# EAGLE design GraphicDisplay (EAGLE 6.5.0)
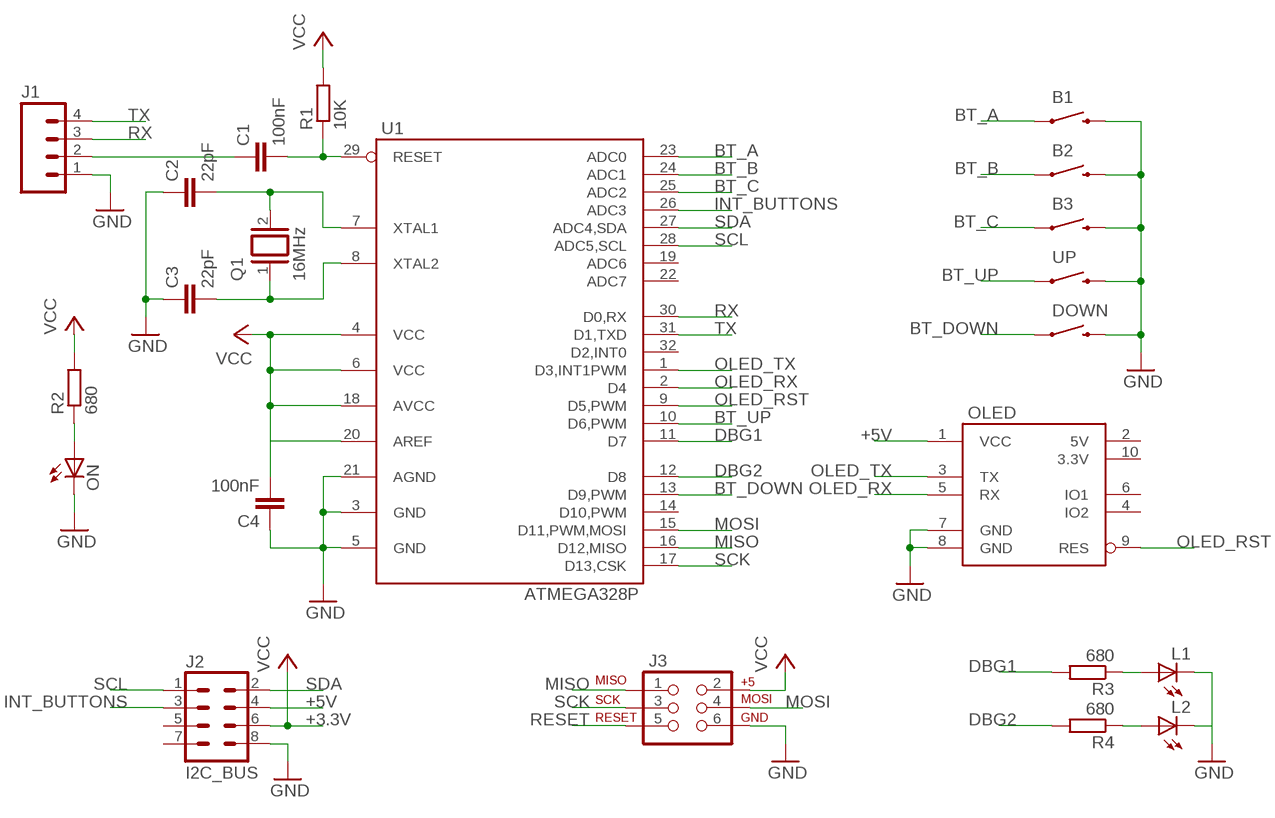
[diagram p0: schematic, sheet 1]

## Parts
B1  SWITCH-MOMENTARY-212MM  [TACTILE-PTH-12MM]
B2  SWITCH-MOMENTARY-212MM  [TACTILE-PTH-12MM]
B3  SWITCH-MOMENTARY-212MM  [TACTILE-PTH-12MM]
C1  100nF  C-EUC0805  [C0805]
C2  22pF  C-EUC0805  [C0805]
C3  22pF  C-EUC0805  [C0805]
C4  100nF  C-EUC0805  [C0805]
DOWN  SWITCH-MOMENTARY-212MM  [TACTILE-PTH-12MM]
J1  M04PTH  [1X04]
J2  I2C_BUS  IDC-SOCKET04X2IDC_SOCKECT04X2_ANGLE  [SOCKET04X2_ANGLE]
J3  AVR_SPI_PRG_6NS  [2X3-NS]
L1  LEDCHIP-LED0805  [CHIP-LED0805]
L2  LEDCHIP-LED0805  [CHIP-LED0805]
OLED  UOLED-160-G2  [UOLED-160-G2]
ON  LEDCHIP-LED0805  [CHIP-LED0805]
Q1  16MHz  XTAL/S  [QS]
R1  10K  R-EU_R0805  [R0805]
R2  680  R-EU_R0805  [R0805]
R3  680  R-EU_R0805  [R0805]
R4  680  R-EU_R0805  [R0805]
U1  ATMEGA328P  ATMEGA328-SMT  [TQFP32-08]
UP  SWITCH-MOMENTARY-212MM  [TACTILE-PTH-12MM]

## Nets
+5V: J2.4 OLED.1(VCC)
BT_A: B1.1 U1.23(ADC0)
BT_B: B2.1 U1.24(ADC1)
BT_C: B3.1 U1.25(ADC2)
BT_DOWN: DOWN.1 U1.13(D9,PWM)
BT_UP: U1.10(D6,PWM) UP.1
DBG1: R3.2 U1.11(D7)
DBG2: R4.2 U1.12(D8)
GND: B1.3 B2.3 B3.3 C2.1 C3.1 C4.1 DOWN.3 J1.1 J2.8 J3.6 L1.C L2.C OLED.7(GND) OLED.8(GND) ON.C U1.3(GND) U1.5(GND) U1.21(AGND) UP.3
INT_BUTTONS: J2.3 U1.26(ADC3)
MISO: J3.1 U1.16(D12,MISO)
MOSI: J3.4 U1.15(D11,PWM,MOSI)
N$1: C1.1 J1.2
N$3: C2.2 Q1.2 U1.7(XTAL1)
N$4: C3.2 Q1.1 U1.8(XTAL2)
N$5: ON.A R2.1
N$6: L1.A R3.1
N$7: L2.A R4.1
OLED_RST: OLED.9(RES) U1.9(D5,PWM)
OLED_RX: OLED.5(RX) U1.2(D4)
OLED_TX: OLED.3(TX) U1.1(D3,INT1PWM)
RESET: C1.2 J3.5 R1.1 U1.29(RESET)
RX: J1.3 U1.30(D0,RX)
SCK: J3.3 U1.17(D13,CSK)
SCL: J2.1 U1.28(ADC5,SCL)
SDA: J2.2 U1.27(ADC4,SDA)
TX: J1.4 U1.31(D1,TXD)
VCC: C4.2 J2.6 J3.2 R1.2 R2.2 U1.4(VCC) U1.6(VCC) U1.18(AVCC) U1.20(AREF)
Unconnected: J2.5 J2.7 OLED.4(IO2) OLED.6(IO1) U1.14(D10,PWM) U1.19(ADC6) U1.22(ADC7) U1.32(D2,INT0)

## Notes on the sheet
- +3.3V

## Power pins joined to a net without a drawn wire
3.3V: OLED.10(3.3V)
5V: OLED.2(5V)

## Library data of the parts
B1-B3 DOWN UP = SparkFun-Electromechanical:SWITCH-MOMENTARY-2: Various NO switches- pushbuttons, reed, etc
C1-C4 = resistor:C-EU: CAPACITOR, European symbol
J1 = SparkFun-Connectors:M04: Header 4 Standard 4-pin 0.1" header. Use with straight break away headers (SKU : PRT-00116), right angle break away headers (PRT-00553), swiss pins (PRT-00743), machine pins (PRT-00117), and female headers (PRT-00115). Molex polarized connector foot print use with SKU : PRT-08231 with associated crimp pins and housings. 1MM SMD Version SKU: PRT-10208
J2 = Connectors:IDC-SOCKET04X2
J3 = SparkFun-Connectors:AVR_SPI_PRG_6: AVR ISP 6 Pin This is the reduced ISP connector for AVR programming. Common on Arduino. This footprint will take up less PCB space and can be used with a 10-pin to 6-pin adapter such as SKU: BOB-08508
L1 L2 ON = led:LED: LED OSRAM: - CHIPLED LG R971, LG N971, LY N971, LG Q971, LY Q971, LO R971, LY R971 LH N974, LH R974 LS Q976, LO Q976, LY Q976 LO Q996 - Hyper CHIPLED LW Q18S LB Q993, LB Q99A, LB R99A - SideLED LS A670, LO A670, LY A670, LG A670, LP A670 LB A673, LV A673, LT A673, LW A673 LH A674 LY A675 LS A676, LA A676, LO A676, LY A676, LW A676 LS A679, LY A679, LG A679 - Hyper Micro SIDELED® LS Y876, LA Y876, LO Y876, LY Y876 LT Y87S - SmartLED LW L88C, LW L88S LB L89C, LB L89S, LG L890 LS L89K, LO L89K, LY L89K LS L896, LA L896, LO L896, LY L896 - TOPLED LS T670, LO T670, LY T670, LG T670, LP T670 LSG T670, LSP T670, LSY T670, LOP T670, LYG T670 LG T671, LOG T671, LSG T671 LB T673, LV T673, LT T673, LW T673 LH T674 LS T676, LA T676, LO T676, LY T676, LB T676, LH T676, LSB T676, LW T676 LB T67C, LV T67C, LT T67C, LS T67K, LO T67K, LY T67K, LW E67C LS E67B, LA E67B, LO E67B, LY E67B, LB E67C, LV E67C, LT E67C LW T67C LS T679, LY T679, LG T679 LS T770, LO T770, LY T770, LG T770, LP T770 LB T773, LV T773, LT T773, LW T773 LH T774 LS E675, LA E675, LY E675, LS T675 LS T776, LA T776, LO T776, LY T776, LB T776 LHGB T686 LT T68C, LB T68C - Hyper Mini TOPLED® LB M676 - Mini TOPLED Santana® LG M470 LS M47K, LO M47K, LY M47K Source: http://www.osram.convergy.de LUXEON: - LUMILED® LXK2-PW12-R00, LXK2-PW12-S00, LXK2-PW14-U00, LXK2-PW14-V00 LXK2-PM12-R00, LXK2-PM12-S00, LXK2-PM14-U00 LXK2-PE12-Q00, LXK2-PE12-R00, LXK2-PE12-S00, LXK2-PE14-T00, LXK2-PE14-U00 LXK2-PB12-K00, LXK2-PB12-L00, LXK2-PB12-M00, LXK2-PB14-N00, LXK2-PB14-P00, LXK2-PB14-Q00 LXK2-PR12-L00, LXK2-PR12-M00, LXK2-PR14-Q00, LXK2-PR14-R00 LXK2-PD12-Q00, LXK2-PD12-R00, LXK2-PD12-S00 LXK2-PH12-R00, LXK2-PH12-S00 LXK2-PL12-P00, LXK2-PL12-Q00, LXK2-PL12-R00 Source: www.luxeon.com KINGBRIGHT: KA-3528ASYC Source: www.kingbright.com
OLED = 4D-Systems:UOLED-160-G2
Q1 = special:XTAL/S: CRYSTAL
R1-R4 = resistor:R-EU_: RESISTOR, European symbol
U1 = Arduino:ATMEGA328-SMT: 32-Pin Atmega328 part Commonly used on Arduino compatible boards Available in QFP and QFN packages TQFP is IC-09069 QFN is non-stock; PROD_ID: IC-09069

## Board
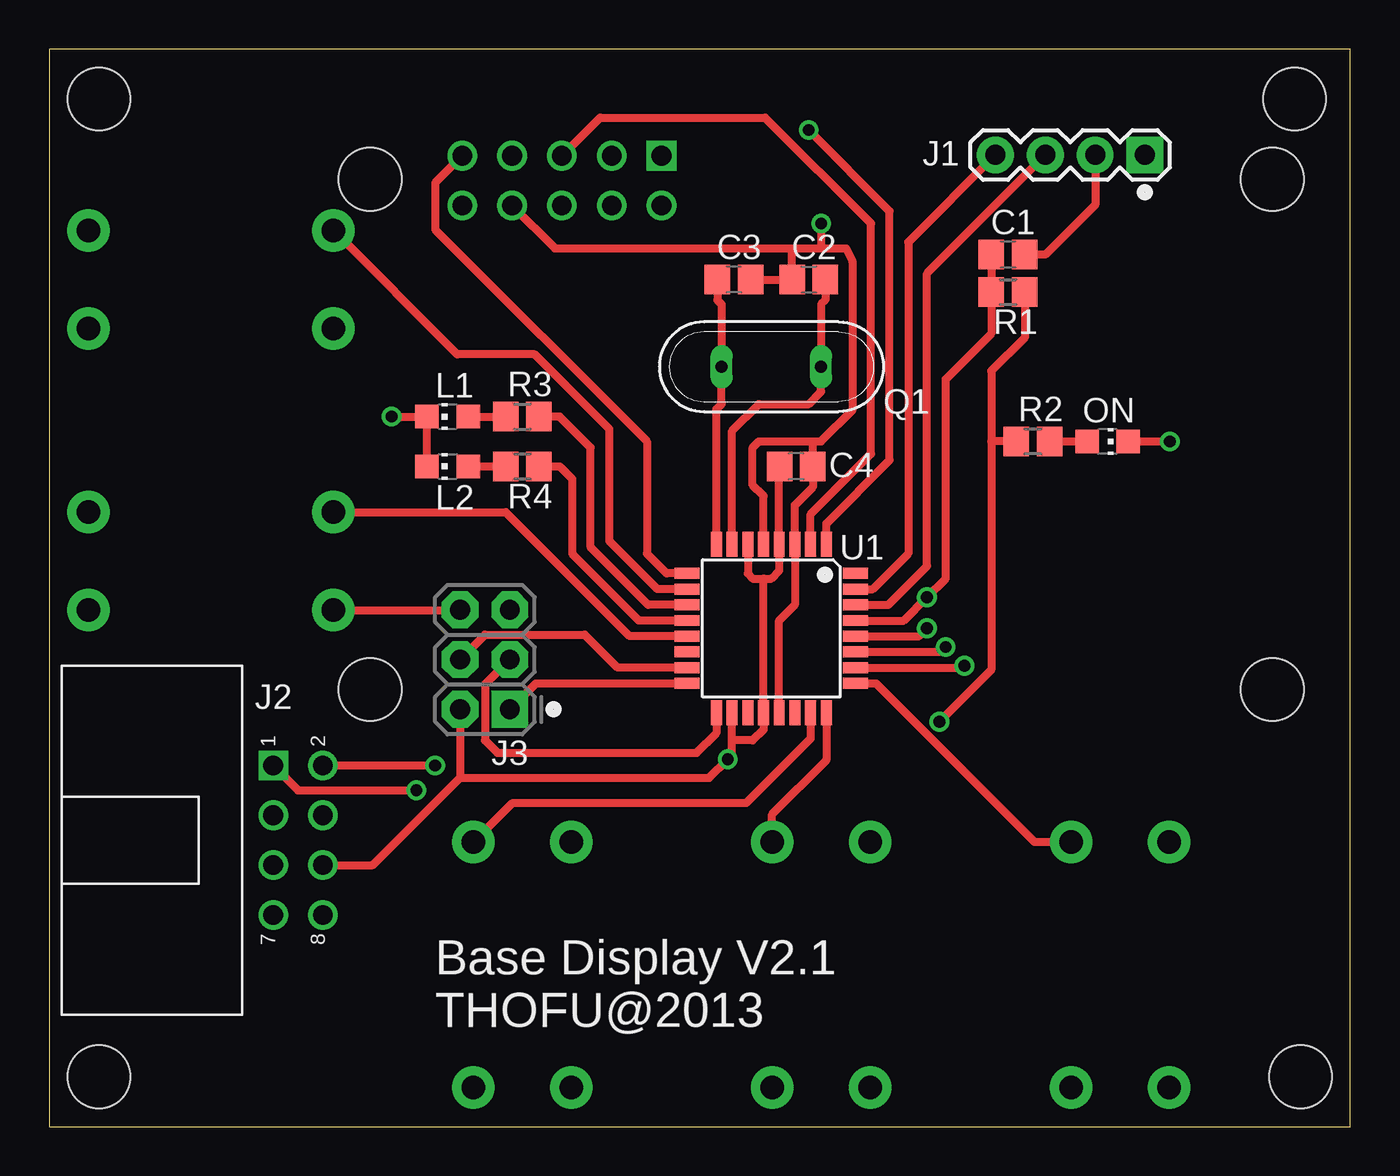
[diagram p1: board, top side]
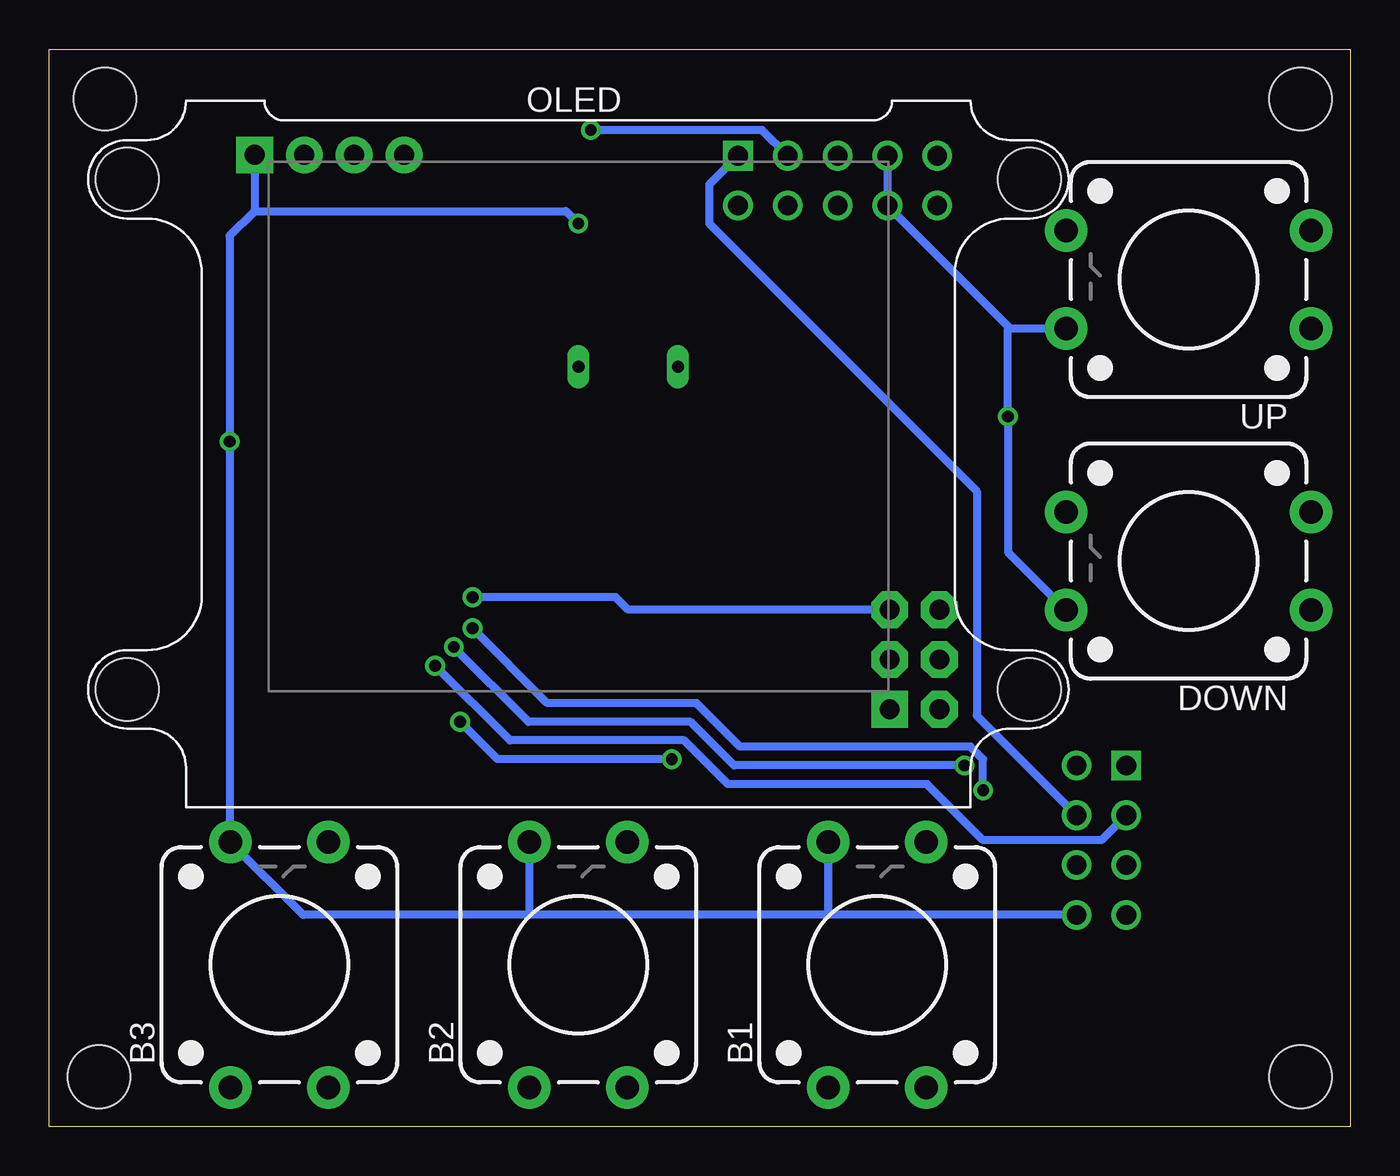
[diagram p2: board, bottom side, seen from below]

Size 66.36 x 54.93 mm. Coordinates in mm from the lower left corner, seen from the top.
Outline: 0,0 66.36,0 66.36,54.93 0,54.93 0,0
Copper layers (1*16): Top 0.035mm / dielectric 1.5mm / Bottom 0.035mm
Design rules "default": minimum track width 10mil, minimum drill 24mil, track to track 8mil, track to pad 8mil, pad to pad 8mil, via to via 8mil, smd to smd 8mil, copper to edge 40mil, drill to drill 8mil, minimum pad ring 10mil, minimum via ring 8mil, stop-mask expansion 4mil, vias tented up to drill 0mil, thermal gap 10mil
Holes 3.2 mm at 2.54,52.39 63.5,52.39 2.54,2.54 63.82,2.54

### Footprints (pad centres in the part's own frame; a part is rotated, then mirrored left to right if it is on the bottom)
TACTILE-PTH-12MM = drill 1.2 pad 2.159: 1 6.25,-2.5; 2 -6.25,-2.5; 3 6.25,2.5; 4 -6.25,2.5
C0805 = smd 1.3 x 1.5: 1 -0.85,0; 2 0.85,0
1X04 = drill 1.016 pad 1.88 square: 1 0,0 | drill 1.016 pad 1.88: 2 2.54,0; 3 5.08,0; 4 7.62,0
SOCKET04X2_ANGLE = drill 1 square: 1 -3.81,-1.27 | drill 1: 2 -3.81,1.27; 3 -1.27,-1.27; 4 -1.27,1.27; 5 1.27,-1.27; 6 1.27,1.27; 7 3.81,-1.27; 8 3.81,1.27
2X3-NS = drill 1.016 pad 1.88 square: 1 -2.54,-1.27 | drill 1.016 pad 1.88 octagon: 2 -2.54,1.27; 3 0,-1.27; 4 0,1.27; 5 2.54,-1.27; 6 2.54,1.27
CHIP-LED0805 = smd 1.2 x 1.2: A 0,-1.05; C 0,1.05
UOLED-160-G2 = drill 1 square: 1 8.14,15.2 | drill 1: 2 8.14,12.66; 3 10.68,15.2; 4 10.68,12.66; 5 13.22,15.2; 6 13.22,12.66; 7 15.76,15.2; 8 15.76,12.66; 9 18.3,15.2; 10 18.3,12.66 | hole 3.2: 23,14; -23,14; -23,-12; 23,-12
QS = drill 0.61 long: 1 -2.54,0; 2 2.54,0
R0805 = smd 1.3 x 1.5: 1 -0.85,0; 2 0.85,0
TQFP32-08 = smd 1.27 x 0.559: 1 -4.293,2.8; 2 -4.293,2; 3 -4.293,1.2; 4 -4.293,0.4; 5 -4.293,-0.4; 6 -4.293,-1.2; 7 -4.293,-2; 8 -4.293,-2.8; 17 4.293,-2.8; 18 4.293,-2; 19 4.293,-1.2; 20 4.293,-0.4; 21 4.293,0.4; 22 4.293,1.2; 23 4.293,2; 24 4.293,2.8 | smd 0.559 x 1.27: 9 -2.8,-4.293; 10 -2,-4.293; 11 -1.2,-4.293; 12 -0.4,-4.293; 13 0.4,-4.293; 14 1.2,-4.293; 15 2,-4.293; 16 2.8,-4.293; 25 2.8,4.293; 26 2,4.293; 27 1.2,4.293; 28 0.4,4.293; 29 -0.4,4.293; 30 -1.2,4.293; 31 -2,4.293; 32 -2.8,4.293

### Placement (x,y rotation side)
B1  24.13,8.26 90 bottom
B2  39.37,8.26 90 bottom
B3  54.61,8.26 90 bottom
C1  48.9,44.45 180 top
C2  38.73,43.18 0 top
C3  34.92,43.18 180 top
C4  38.1,33.66 180 top
DOWN  8.26,28.83 180 bottom
J1  55.88,49.53 180 top
J2  12.7,14.61 270 top
J3  22.23,23.81 90 top
L1  20.32,36.2 90 top
L2  20.32,33.66 90 top
OLED  39.37,34.29 0 bottom
ON  53.98,34.92 270 top
Q1  36.83,38.73 0 top
R1  48.9,42.55 0 top
R2  50.16,34.92 180 top
R3  24.13,36.2 0 top
R4  24.13,33.66 0 top
U1  36.83,25.4 270 top
UP  8.26,43.18 180 bottom

### Tracks (layer width: path | path; a pad name or v marks a point on that pad's centre or on a via)
+5V
  Bottom 0.406: OLED.1 32.7,48.02 32.7,46.04 19.05,32.38 19.05,20.95 J2.4
BT_A
  Top 0.406: U1.23 38.83,19.78 35.56,16.51 23.64,16.51 B1.1
BT_B
  Top 0.406: U1.24 39.63,18.68 36.87,15.91 B2.1
BT_C
  Top 0.406: U1.25 42.17,22.6 50.27,14.51 B3.1
BT_DOWN
  Top 0.406: U1.13 29.61,25 23.28,31.33 DOWN.1
BT_UP
  Top 0.406: U1.10 31.02,27.4 28.57,29.84 28.57,35.56 24.77,39.37 20.82,39.37 UP.1
DBG1
  Top 0.406: U1.11 30.55,26.6 27.62,29.53 27.62,34.61 26.04,36.2 R3.2
DBG2
  Top 0.406: R4.2 26.04,33.66 26.67,33.02 26.67,29.21 30.08,25.8 U1.12
GND  (via drill 0.6)
  Top 0.406: C3.1 C2.1 37.88,44.77 | 39.37,44.77 40.64,44.77 40.96,44.13 40.96,36.51 39.37,34.92 39.05,34.92 | L2.C L1.C v17.46,36.2 | U1.21 37.23,25.8 38.03,26.6 U1.3 38.03,31.68 38.95,32.6 C4.1 38.95,34.82 39.05,34.92 | U1.5 36.43,32.15 35.88,32.7 35.88,34.61 36.2,34.92 39.05,34.92 | v39.37,46.04 39.37,44.77 | OLED.8 25.79,44.77 37.88,44.77 | 37.88,44.77 39.37,44.77 | ON.C v57.15,34.92 | DOWN.3 20.93,26.33 J3.6
  Bottom 0.406: 26.63,10.79 41.87,10.79 | B2.3 41.87,10.79 | B1.3 26.63,10.79 | 41.87,10.79 53.4,10.79 B3.3 57.15,14.54 v57.15,34.92 57.15,45.4 55.88,46.67 | 55.88,46.67 40.01,46.67 v39.37,46.04 | J1.1 55.88,46.67 | J2.8 26.63,10.79 | OLED.7 OLED.8 17.34,40.68 | UP.3 17.34,40.68 | 17.34,40.68 17.46,40.68 v17.46,36.2 17.46,29.29 DOWN.3
INT_BUTTONS  (via drill 0.6)
  Top 0.406: U1.26 46.58,23.4 v46.67,23.5
  Bottom 0.406: J2.3 12.7,14.61 18.73,14.61 21.59,17.46 31.75,17.46 33.97,19.68 42.86,19.68 v46.67,23.5
MISO
  Top 0.406: J3.1 24.82,22.6 U1.16
MOSI
  Top 0.406: J3.4 22.23,25.08 27.3,25.08 28.99,23.4 U1.15
N$1
  Top 0.406: J1.2 53.34,46.99 50.8,44.45 C1.1
N$3
  Top 0.406: C2.2 39.59,42.12 39.37,41.91 Q1.2 39.37,37.47 38.73,36.83 36.2,36.83 34.83,35.47 U1.7
N$4
  Top 0.406: C3.2 34.08,42.12 34.29,41.91 Q1.1 34.29,36.83 34.03,36.57 U1.8
N$5
  Top 0.406: R2.1 ON.A
N$6
  Top 0.406: L1.A R3.1
N$7
  Top 0.406: L2.A R4.1
OLED_RST
  Top 0.406: U1.9 31.49,28.2 30.48,29.21 30.48,34.92 19.68,45.72 19.68,48.1 OLED.9
OLED_RX
  Top 0.406: U1.2 38.83,31.21 41.91,34.29 41.91,46.04 36.51,51.44 28.09,51.44 OLED.5
OLED_TX  (via drill 0.6)
  Top 0.406: U1.1 39.63,30.74 42.86,33.97 42.86,46.67 v38.73,50.8
  Bottom 0.406: OLED.3 30,50.8 v38.73,50.8
RESET  (via drill 0.6)
  Top 0.406: C1.2 R1.1 48.05,40.42 45.72,38.1 45.72,27.94 v44.77,26.99 43.58,25.8 U1.29
  Bottom 0.406: J3.5 36.83,26.35 37.47,26.99 v44.77,26.99
RX
  Top 0.406: J1.3 44.77,43.5 44.77,28.57 42.79,26.6 U1.30
SCK
  Top 0.406: J3.3 22.23,22.54 22.23,19.68 22.86,19.05 33.02,19.05 34.03,20.06 U1.17
SCL  (via drill 0.6)
  Top 0.406: J2.1 12.7,17.14 v18.73,17.14 | U1.28 44.37,25 v44.77,25.4
  Bottom 0.406: v18.73,17.14 18.73,18.73 19.37,19.37 31.11,19.37 33.34,21.59 40.96,21.59 v44.77,25.4
SDA  (via drill 0.6)
  Top 0.406: J2.2 v19.68,18.41 | U1.27 45.47,24.2 v45.72,24.45
  Bottom 0.406: v45.72,24.45 41.91,20.64 33.66,20.64 31.43,18.41 v19.68,18.41
TX
  Top 0.406: J1.4 43.81,45.09 43.81,29.21 42.01,27.4 U1.31
VCC  (via drill 0.6)
  Top 0.406: C4.2 37.23,33.63 U1.4 37.23,28.34 36.83,27.94 36.43,27.94 | J3.2 20.95,17.78 | 20.95,17.78 33.66,17.78 v34.61,18.73 34.83,18.95 34.83,19.68 | 36.43,27.94 U1.20 36.43,20.24 35.88,19.68 34.83,19.68 | U1.6 35.63,28.19 35.88,27.94 36.43,27.94 | 34.83,19.68 U1.18 | 20.95,17.78 16.51,13.34 J2.6 | R1.2 49.74,40.22 48.05,38.52 48.05,34.92 | 48.05,34.92 48.05,23.28 v45.4,20.64 | R2.2 48.05,34.92
  Bottom 0.406: v34.61,18.73 43.5,18.73 v45.4,20.64

### Text on the board
tNames: Base Display V2.1 / THOFU@2013